# Altium project ASM2464PD.PrjPcb
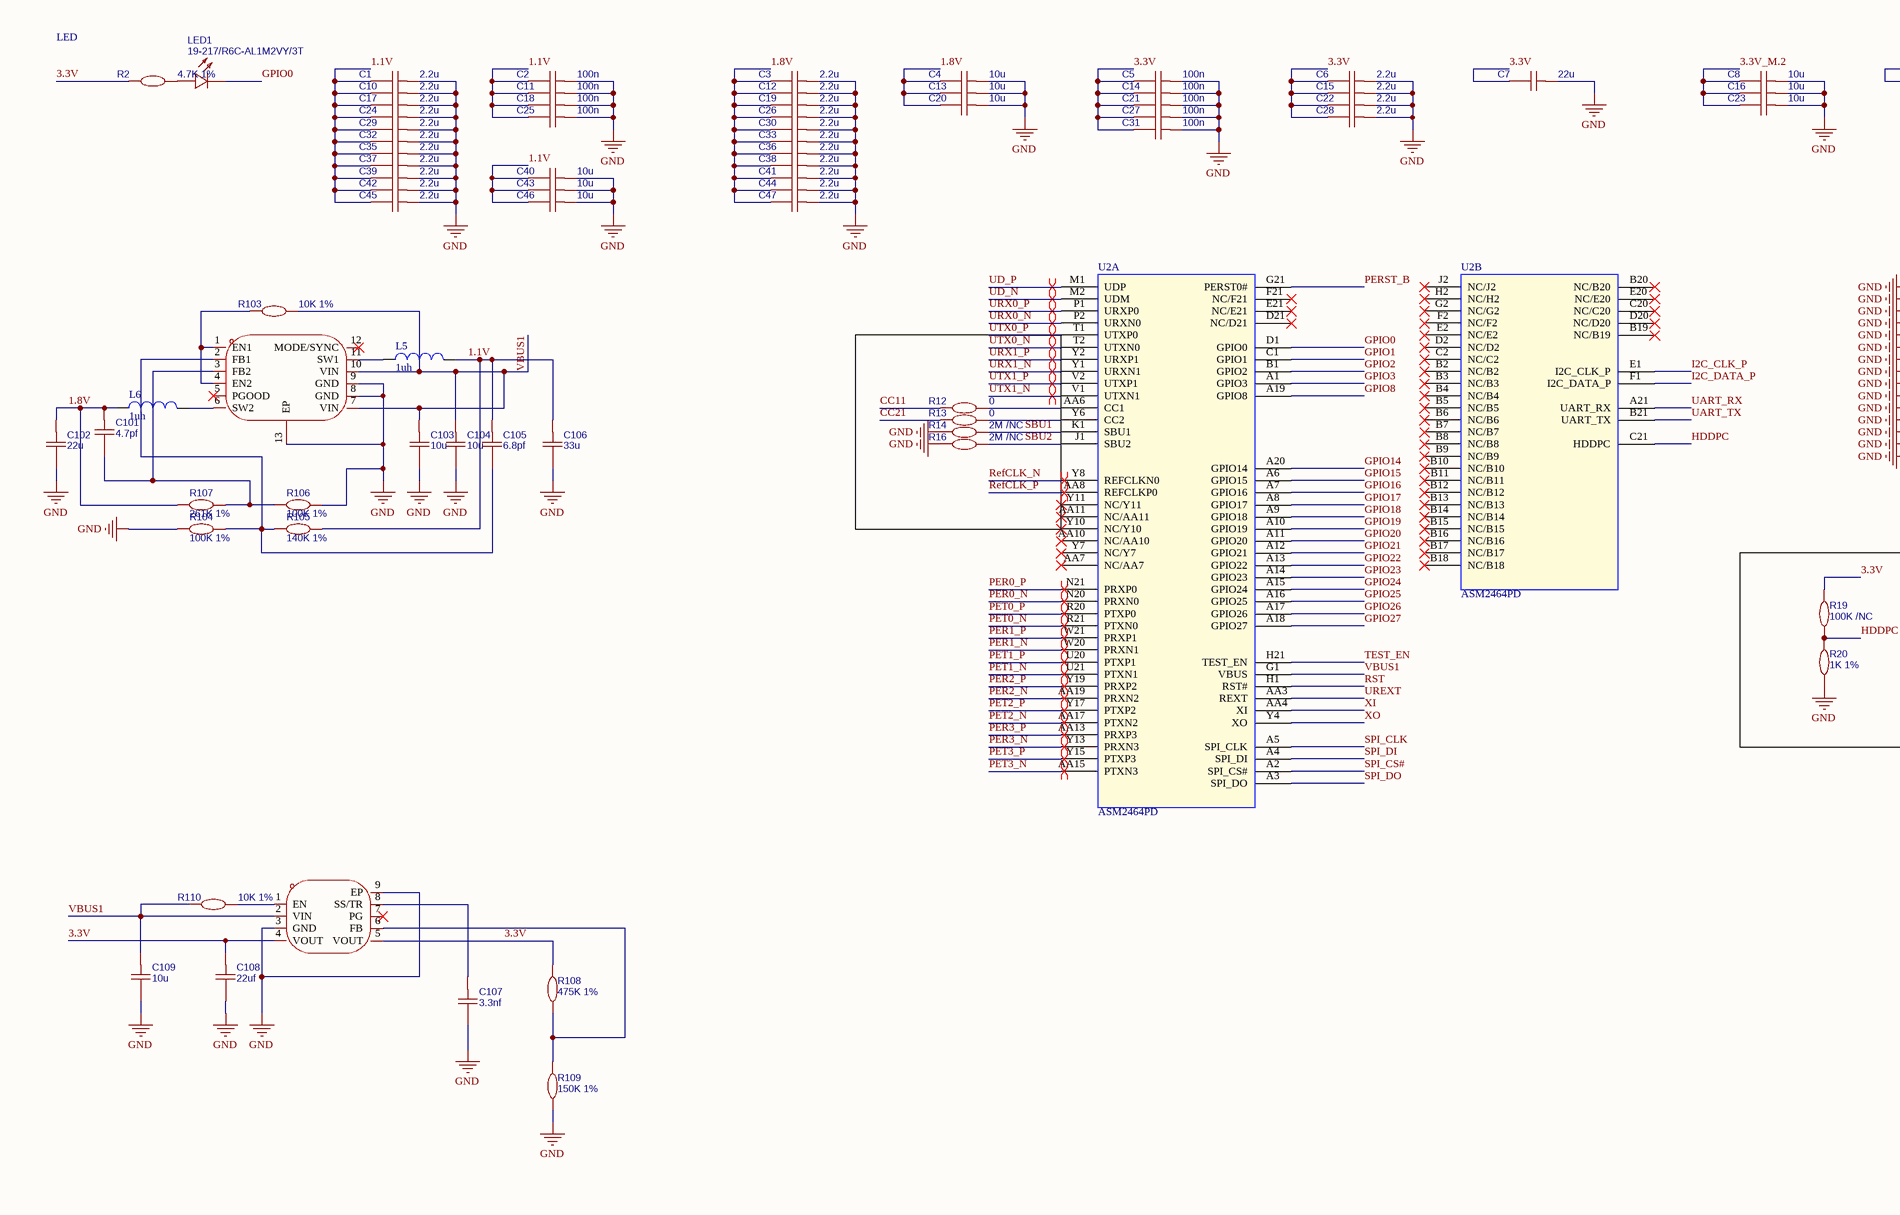
[diagram p0: ASM2464PD.SchDoc, top left]
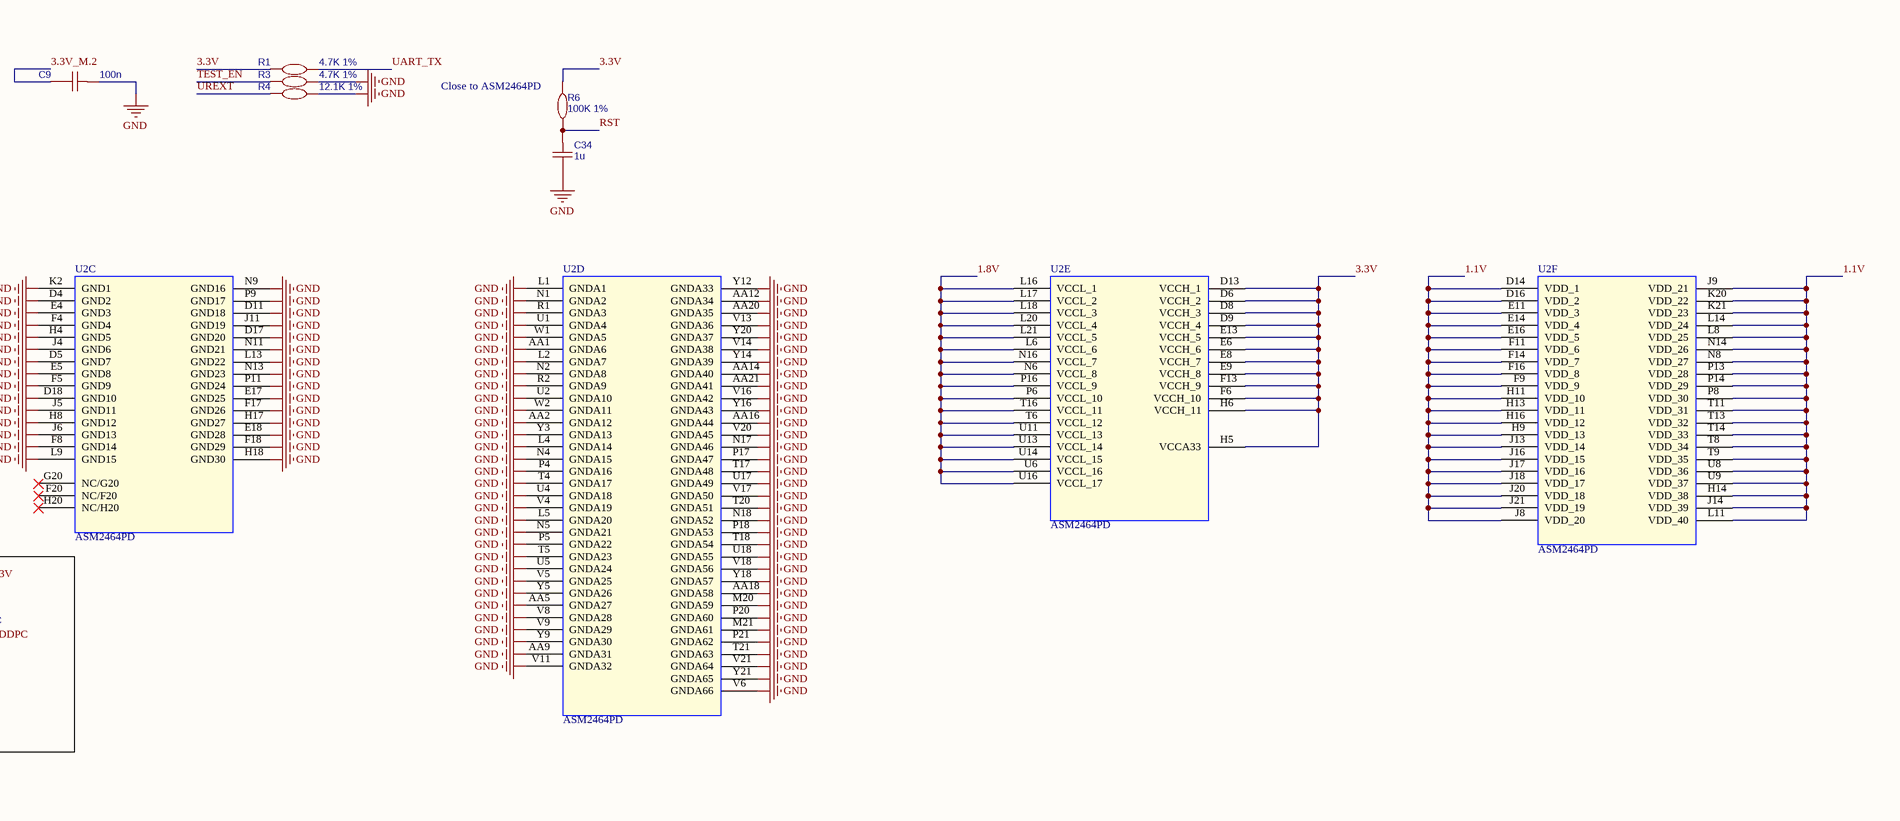
[diagram p1: ASM2464PD.SchDoc, top right]
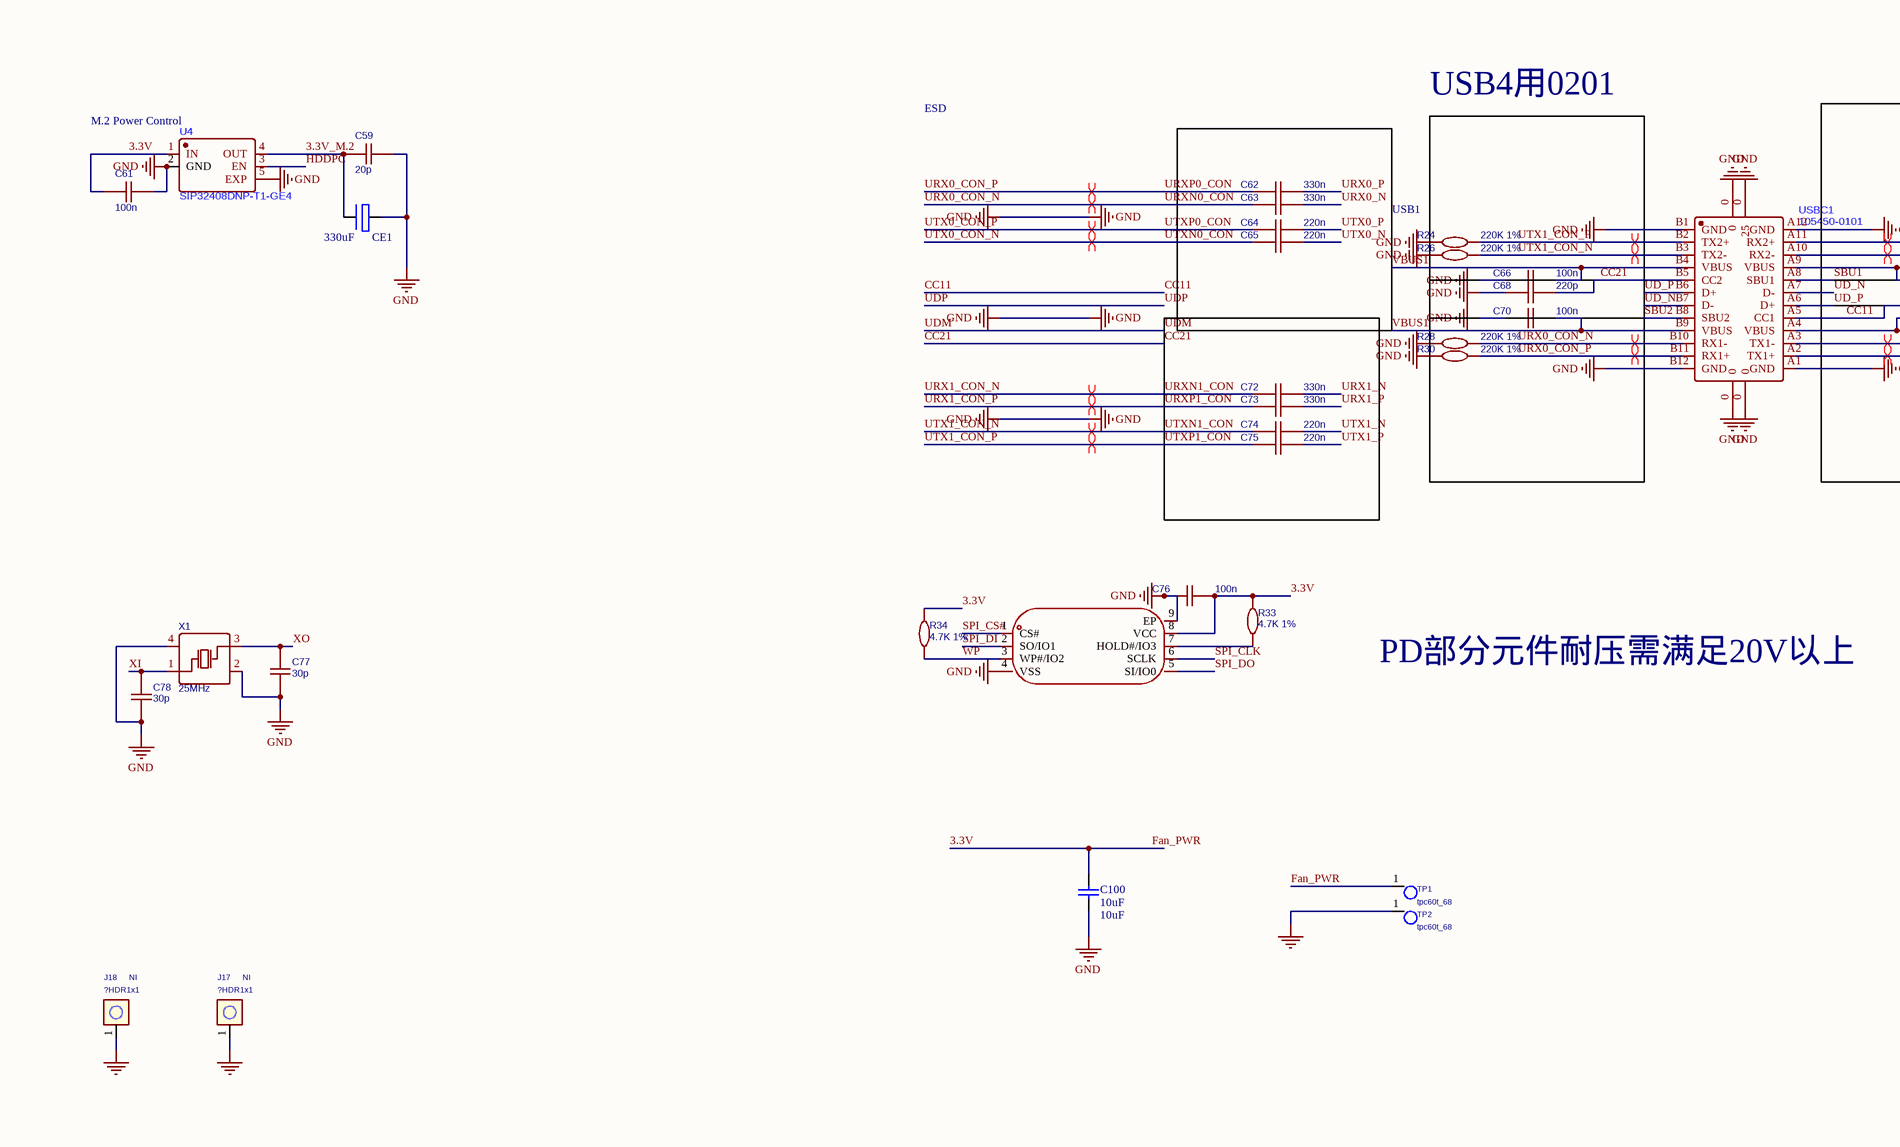
[diagram p2: ASM2464PD.SchDoc, bottom left]
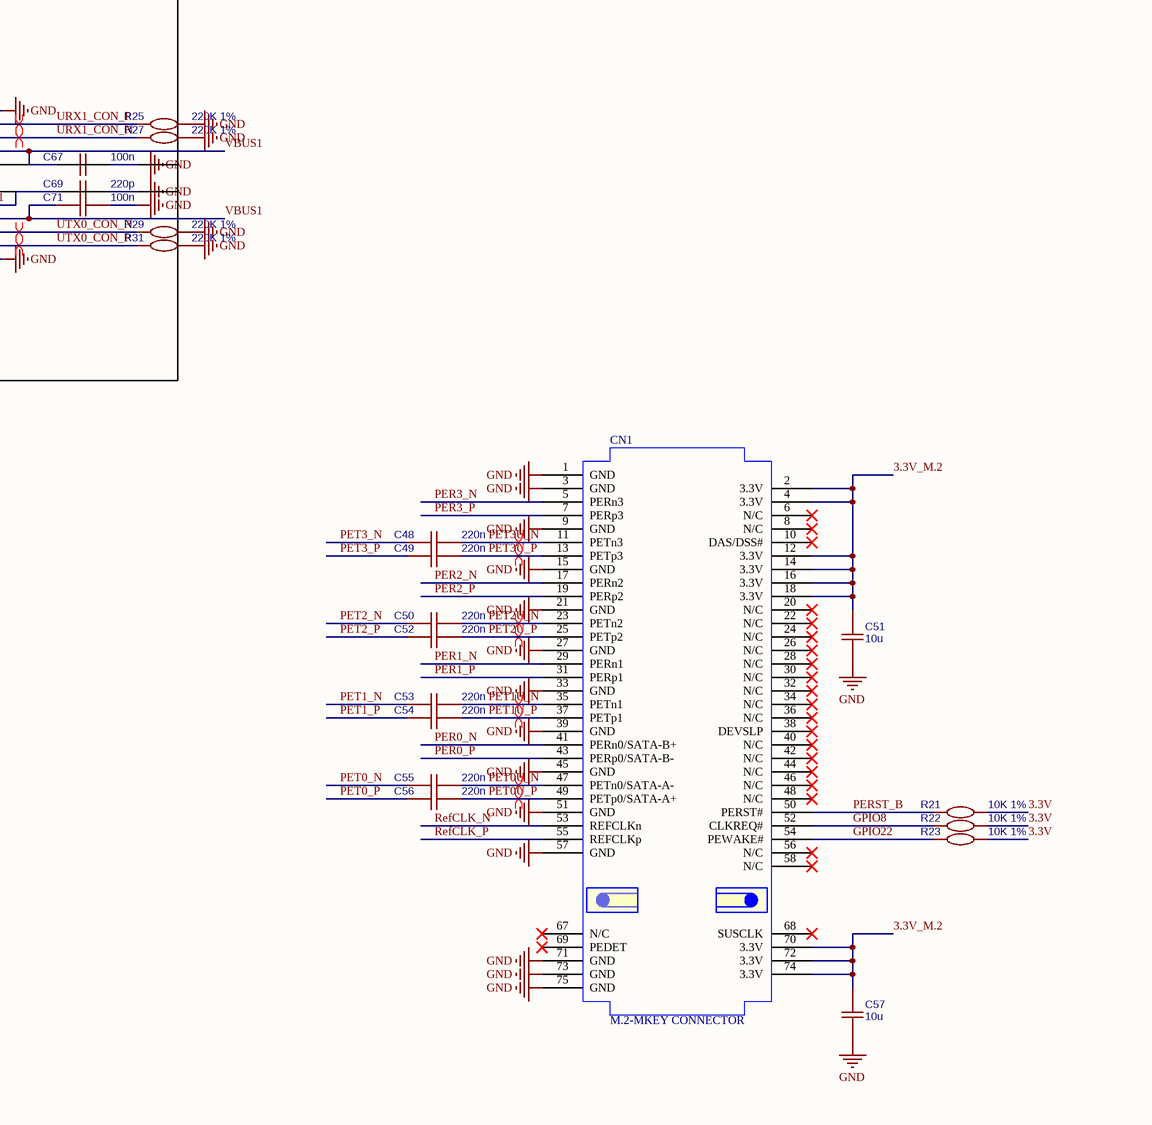
[diagram p3: ASM2464PD.SchDoc, bottom right]
1 sheet, 134 parts. Net scope: global (net labels, ports and power ports of the same name join across sheets).
Board file: ASM2464PD - B2 Sample.PcbDoc

## Sheet ASM2464PD.SchDoc
size A1; SheetNumber: 1; SheetTotal: 1

### Parts
C1  2.2u  [C0402]
C2  100n  [C0402]
C3  2.2u  [C0402]
C4  10u  [C0402]
C5  100n  [C0402]
C6  2.2u  [C0402]
C7  22u  [C0402]
C8  10u  [C0402]
C9  100n  [C0402]
C10  2.2u  [C0402]
C11  100n  [C0402]
C12  2.2u  [C0402]
C13  10u  [C0402]
C14  100n  [C0402]
C15  2.2u  [C0402]
C16  10u  [C0402]
C17  2.2u  [C0402]
C18  100n  [C0402]
C19  2.2u  [C0402]
C20  10u  [C0402]
C21  100n  [C0402]
C22  2.2u  [C0402]
C23  10u  [C0402]
C24  2.2u  [C0402]
C25  100n  [C0402]
C26  2.2u  [C0402]
C27  100n  [C0402]
C28  2.2u  [C0402]
C29  2.2u  [C0402]
C30  2.2u  [C0402]
C31  100n  [C0402]
C32  2.2u  [C0402]
C33  2.2u  [C0402]
C34  1u  [C0402]
C35  2.2u  [C0402]
C36  2.2u  [C0402]
C37  2.2u  [C0402]
C38  2.2u  [C0402]
C39  2.2u  [C0402]
C40  10u  [C0402]
C41  2.2u  [C0402]
C42  2.2u  [C0402]
C43  10u  [C0402]
C44  2.2u  [C0402]
C45  2.2u  [C0402]
C46  10u  [C0402]
C47  2.2u  [C0402]
C48  220n  [C0201]
C49  220n  [C0201]
C50  220n  [C0201]
C51  10u  [C0402]
C52  220n  [C0201]
C53  220n  [C0201]
C54  220n  [C0201]
C55  220n  [C0201]
C56  220n  [C0201]
C57  10u  [C0402]
C59  20p  [C0402]
C61  100n  [C0402]
C62  330n  [C0201]
C63  330n  [C0201]
C64  220n  [C0201]
C65  220n  [C0201]
C66  100n  [C0402]
C67  100n  [C0402]
C68  220p  [C0402]
C69  220p  [C0402]
C70  100n  [C0402]
C71  100n  [C0402]
C72  330n  [C0201]
C73  330n  [C0201]
C74  220n  [C0201]
C75  220n  [C0201]
C76  100n  [C0402]
C77  30p  [C0402]
C78  30p  [C0402]
C100  10uF  [C0402]
C101  4.7pf  [C0402]
C102  22u  [C0402]
C103  10u  [C0402]
C104  10u  [C0402]
C105  6.8pf  [C0402]
C106  33u  [C0402]
C107  3.3nf  [C0402]
C108  22uf  [C0402]
C109  10u  [C0402]
CE1  330uF  [CAP-SMD_L7.3-W4.3-R-RD]
CN1  M.2-MKEY CONNECTOR  [CONN-SMD_APCI0113-P001A]
J17  ?HDR1x1  Installed: NI  [Header]
J18  ?HDR1x1  Installed: NI  [Header]
L5  1uh  [IND-SMD_L2.0-W1.6-B]
L6  1uh  [IND-SMD_L2.0-W1.6-B]
LED1  19-217/R6C-AL1M2VY/3T  [LED0402-RD]
R1  4.7K 1%  [R0402]
R2  4.7K 1%  [R0402]
R3  4.7K 1%  [R0402]
R4  12.1K 1%  [R0402]
R6  100K 1%  [R0402]
R12  0  [R0402]
R13  0  [R0402]
R14  2M /NC  [R0402]
R16  2M /NC  [R0402]
R19  100K /NC  [R0402]
R20  1K 1%  [R0402]
R21  10K 1%  [R0402]
R22  10K 1%  [R0402]
R23  10K 1%  [R0402]
R24  220K 1%  [R0201]
R25  220K 1%  [R0201]
R26  220K 1%  [R0201]
R27  220K 1%  [R0201]
R28  220K 1%  [R0201]
R29  220K 1%  [R0201]
R30  220K 1%  [R0201]
R31  220K 1%  [R0201]
R33  4.7K 1%  [R0402]
R34  4.7K 1%  [R0402]
R103  10K 1%  [R0402]
R104  100K 1%  [R0402]
R105  140K 1%  [R0402]
R106  100K 1%  [R0402]
R107  261K 1%  [R0402]
R108  475K 1%  [R0402]
R109  150K 1%  [R0402]
R110  10K 1%  [R0402]
TP1  tpc60t_68  [tpc60t_68]
TP2  tpc60t_68  [tpc60t_68]
U01  LTC3315AEV#TRPBF  [LQFN-12_L2.0-W2.0-P0.50-TL-EP0.7]  (value not drawn)
U2  ASM2464PD  [BGA273C46P21X21_1000X1000X98]  (parts A,B,C,D,E,F of 6)
U02  TPS82130SILR  [USIP-8_L3.0-W2.8-P0.65-TL-EP]  (value not drawn)
U4  SIP32408DNP-T1-GE4  [SIP32408DNP-T1-GE4]
U31  ZD25WQ16CEIGR  [USON-8_L3.0-W2.0-P0.50-BL-EP]  (value not drawn)
USBC1  105450-0101  [USB-C-SMD_TYPE-C-USB-18]
X1  25MHz  [CRYSTAL-SMD_4P-L1.6-W1.2-BL]

### Blocks framed on the sheet
USB4用0201: C66 C68 C70 R24 R26

### Nets
GND: C1.2 C2.2 C3.2 C4.2 C5.2 C6.2 C7.2 C8.2 C9.2 C10.2 C11.2 C12.2 C13.2 C14.2 C15.2 C16.2 C17.2 C18.2 C19.2 C20.2 C21.2 C22.2 C23.2 C24.2 C25.2 C26.2 C27.2 C28.2 C29.2 C30.2 C31.2 C32.2 C33.2 C34.1 C35.2 C36.2 C37.2 C38.2 C39.2 C40.2 C41.2 C42.2 C43.2 C44.2 C45.2 C46.2 C47.2 C51.2 C57.2 C59.2 C61.2 C66.1 C67.2 C68.1 C69.2 C70.1 C71.2 C76.1 C77.2 C78.2 C100.2 C102.1 C103.1 C104.1 C106.1 C107.1 C108.1 C109.1 CE1.2 CN1.1(GND) CN1.3(GND) CN1.9(GND) CN1.15(GND) CN1.21(GND) CN1.27(GND) CN1.33(GND) CN1.39(GND) CN1.45(GND) CN1.51(GND) CN1.57(GND) CN1.71(GND) CN1.73(GND) CN1.75(GND) J17.1 J18.1 R3.2 R4.2 R14.1 R16.1 R20.1 R24.1 R25.2 R26.1 R27.2 R28.1 R29.2 R30.1 R31.2 R104.2 R106.1 R109.2 TP2.1 U01.8(GND) U01.9(GND) U01.13(EP) U02.3(GND) U02.9(EP) U2.AA1(GNDA6) U2.AA2(GNDA12) U2.AA5(GNDA27) U2.AA9(GNDA31) U2.AA12(GNDA34) U2.AA14(GNDA40) U2.AA16(GNDA44) U2.AA18(GNDA58) U2.AA20(GNDA35) U2.AA21(GNDA41) U2.D4(GND2) U2.D5(GND7) U2.D11(GND18) U2.D17(GND20) U2.D18(GND10) U2.E4(GND3) U2.E5(GND8) U2.E17(GND25) U2.E18(GND28) U2.F4(GND4) U2.F5(GND9) U2.F8(GND14) U2.F17(GND26) U2.F18(GND29) U2.H4(GND5) U2.H8(GND12) U2.H17(GND27) U2.H18(GND30) U2.J4(GND6) U2.J5(GND11) U2.J6(GND13) U2.J11(GND19) U2.K2(GND1) U2.L1(GNDA1) U2.L2(GNDA7) U2.L4(GNDA14) U2.L5(GNDA20) U2.L9(GND15) U2.L13(GND22) U2.M20(GNDA59) U2.M21(GNDA61) U2.N1(GNDA2) U2.N2(GNDA8) U2.N4(GNDA15) U2.N5(GNDA21) U2.N9(GND16) U2.N11(GND21) U2.N13(GND23) U2.N17(GNDA46) U2.N18(GNDA52) U2.P4(GNDA16) U2.P5(GNDA22) U2.P9(GND17) U2.P11(GND24) U2.P17(GNDA47) U2.P18(GNDA53) U2.P20(GNDA60) U2.P21(GNDA62) U2.R1(GNDA3) U2.R2(GNDA9) U2.T4(GNDA17) U2.T5(GNDA23) U2.T17(GNDA48) U2.T18(GNDA54) U2.T20(GNDA51) U2.T21(GNDA63) U2.U1(GNDA4) U2.U2(GNDA10) U2.U4(GNDA18) U2.U5(GNDA24) U2.U17(GNDA49) U2.U18(GNDA55) U2.V4(GNDA19) U2.V5(GNDA25) U2.V6(GNDA66) U2.V8(GNDA28) U2.V9(GNDA29) U2.V11(GNDA32) U2.V13(GNDA36) U2.V14(GNDA38) U2.V16(GNDA42) U2.V17(GNDA50) U2.V18(GNDA56) U2.V20(GNDA45) U2.V21(GNDA64) U2.W1(GNDA5) U2.W2(GNDA11) U2.Y3(GNDA13) U2.Y5(GNDA26) U2.Y9(GNDA30) U2.Y12(GNDA33) U2.Y14(GNDA39) U2.Y16(GNDA43) U2.Y18(GNDA57) U2.Y20(GNDA37) U2.Y21(GNDA65) U4.2(GND) U4.5(EXP) U31.4(VSS) U31.9(EP) USBC1.0 USBC1.A1(GND) USBC1.A12(GND) USBC1.B1(GND) USBC1.B12(GND) X1.2(GND) X1.4(GND)
1.1V: C1.1 C2.1 C10.1 C11.1 C17.1 C18.1 C24.1 C25.1 C29.1 C32.1 C35.1 C37.1 C39.1 C40.1 C42.1 C43.1 C45.1 C46.1 C105.2 C106.2 L5.2 R105.1 U2.D14(VDD_1) U2.D16(VDD_2) U2.E11(VDD_3) U2.E14(VDD_4) U2.E16(VDD_5) U2.F9(VDD_9) U2.F11(VDD_6) U2.F14(VDD_7) U2.F16(VDD_8) U2.H9(VDD_13) U2.H11(VDD_10) U2.H13(VDD_11) U2.H14(VDD_38) U2.H16(VDD_12) U2.J8(VDD_20) U2.J9(VDD_21) U2.J13(VDD_14) U2.J14(VDD_39) U2.J16(VDD_15) U2.J17(VDD_16) U2.J18(VDD_17) U2.J20(VDD_18) U2.J21(VDD_19) U2.K20(VDD_22) U2.K21(VDD_23) U2.L8(VDD_25) U2.L11(VDD_40) U2.L14(VDD_24) U2.N8(VDD_27) U2.N14(VDD_26) U2.P8(VDD_30) U2.P13(VDD_28) U2.P14(VDD_29) U2.T8(VDD_34) U2.T9(VDD_35) U2.T11(VDD_31) U2.T13(VDD_32) U2.T14(VDD_33) U2.U8(VDD_36) U2.U9(VDD_37)
1.8V: C3.1 C4.1 C12.1 C13.1 C19.1 C20.1 C26.1 C30.1 C33.1 C36.1 C38.1 C41.1 C44.1 C47.1 C101.2 C102.2 L6.1 R107.2 U2.L6(VCCL_6) U2.L16(VCCL_1) U2.L17(VCCL_2) U2.L18(VCCL_3) U2.L20(VCCL_4) U2.L21(VCCL_5) U2.N6(VCCL_8) U2.N16(VCCL_7) U2.P6(VCCL_10) U2.P16(VCCL_9) U2.T6(VCCL_12) U2.T16(VCCL_11) U2.U6(VCCL_16) U2.U11(VCCL_13) U2.U13(VCCL_14) U2.U14(VCCL_15) U2.U16(VCCL_17)
3.3V: C5.1 C6.1 C7.1 C14.1 C15.1 C21.1 C22.1 C27.1 C28.1 C31.1 C61.1 C76.2 C100.1 C108.2 R1.1 R2.1 R6.2 R19.2 R21.2 R22.2 R23.2 R33.1 R34.1 R108.1 TP1.1 U02.4(VOUT) U02.5(VOUT) U2.D6(VCCH_2) U2.D8(VCCH_3) U2.D9(VCCH_4) U2.D13(VCCH_1) U2.E6(VCCH_6) U2.E8(VCCH_7) U2.E9(VCCH_8) U2.E13(VCCH_5) U2.F6(VCCH_10) U2.F13(VCCH_9) U2.H5(VCCA33) U2.H6(VCCH_11) U4.1(IN) U31.8(VCC)  [also labelled Fan_PWR]
3.3V_M.2: C8.1 C9.1 C16.1 C23.1 C51.1 C57.1 C59.1 CE1.1 CN1.2(3.3V) CN1.4(3.3V) CN1.12(3.3V) CN1.14(3.3V) CN1.16(3.3V) CN1.18(3.3V) CN1.70(3.3V) CN1.72(3.3V) CN1.74(3.3V) U4.4(OUT)
CC11: C69.1 R12.1 USBC1.A5(CC1)
CC21: C68.2 R13.1 USBC1.B5(CC2)
GPIO0: LED1.2(C) U2.D1(GPIO0)
GPIO1: U2.C1(GPIO1)
GPIO2: U2.B1(GPIO2)
GPIO3: U2.A1(GPIO3)
GPIO8: CN1.52(CLKREQ#) R22.1 U2.A19(GPIO8)
GPIO14: U2.A20(GPIO14)
GPIO15: U2.A6(GPIO15)
GPIO16: U2.A7(GPIO16)
GPIO17: U2.A8(GPIO17)
GPIO18: U2.A9(GPIO18)
GPIO19: U2.A10(GPIO19)
GPIO20: U2.A11(GPIO20)
GPIO21: U2.A12(GPIO21)
GPIO22: CN1.54(PEWAKE#) R23.1 U2.A13(GPIO22)
GPIO23: U2.A14(GPIO23)
GPIO24: U2.A15(GPIO24)
GPIO25: U2.A16(GPIO25)
GPIO26: U2.A17(GPIO26)
GPIO27: U2.A18(GPIO27)
HDDPC: R19.1 R20.2 U2.C21(HDDPC) U4.3(EN)
I2C_CLK_P: U2.E1(I2C_CLK_P)
I2C_DATA_P: U2.F1(I2C_DATA_P)
PER0_N: CN1.41(PERn0/SATA-B+) U2.N20(PRXN0)
PER0_P: CN1.43(PERp0/SATA-B-) U2.N21(PRXP0)
PER1_N: CN1.29(PERn1) U2.W20(PRXN1)
PER1_P: CN1.31(PERp1) U2.W21(PRXP1)
PER2_N: CN1.17(PERn2) U2.AA19(PRXN2)
PER2_P: CN1.19(PERp2) U2.Y19(PRXP2)
PER3_N: CN1.5(PERn3) U2.Y13(PRXN3)
PER3_P: CN1.7(PERp3) U2.AA13(PRXP3)
PERST_B: CN1.50(PERST#) R21.1 U2.G21(PERST0#)
PET0_N: C55.1 U2.R21(PTXN0)
PET0_P: C56.1 U2.R20(PTXP0)
PET0U_N: C55.2 CN1.47(PETn0/SATA-A-)
PET0U_P: C56.2 CN1.49(PETp0/SATA-A+)
PET1_N: C53.1 U2.U21(PTXN1)
PET1_P: C54.1 U2.U20(PTXP1)
PET1U_N: C53.2 CN1.35(PETn1)
PET1U_P: C54.2 CN1.37(PETp1)
PET2_N: C50.1 U2.AA17(PTXN2)
PET2_P: C52.1 U2.Y17(PTXP2)
PET2U_N: C50.2 CN1.23(PETn2)
PET2U_P: C52.2 CN1.25(PETp2)
PET3_N: C48.1 U2.AA15(PTXN3)
PET3_P: C49.1 U2.Y15(PTXP3)
PET3U_N: C48.2 CN1.11(PETn3)
PET3U_P: C49.2 CN1.13(PETp3)
RefCLK_N: CN1.53(REFCLKn) U2.Y8(REFCLKN0)
RefCLK_P: CN1.55(REFCLKp) U2.AA8(REFCLKP0)
RST: C34.2 R6.1 U2.H1(RST#)
SBU1: R14.2 U2.K1(SBU1) USBC1.A8(SBU1)
SBU2: R16.2 U2.J1(SBU2) USBC1.B8(SBU2)
SPI_CLK: U2.A5(SPI_CLK) U31.6(SCLK)
SPI_CS#: U2.A2(SPI_CS#) U31.1(CS#)
SPI_DI: U2.A4(SPI_DI) U31.2(SO/IO1)
SPI_DO: U2.A3(SPI_DO) U31.5(SI/IO0)
TEST_EN: R3.1 U2.H21(TEST_EN)
UART_RX: U2.A21(UART_RX)
UART_TX: R1.2 U2.B21(UART_TX)
UD_N: U2.M2(UDM) USBC1.A7(D-) USBC1.B7(D-)
UD_P: U2.M1(UDP) USBC1.A6(D+) USBC1.B6(D+)
UREXT: R4.1 U2.AA3(REXT)
URX0_CON_N: C63.1 R28.2 USBC1.B10(RX1-)  [also labelled URXN0_CON]
URX0_CON_P: C62.1 R30.2 USBC1.B11(RX1+)  [also labelled URXP0_CON]
URX0_N: C63.2 U2.P2(URXN0)
URX0_P: C62.2 U2.P1(URXP0)
URX1_CON_N: C72.1 R27.1 USBC1.A10(RX2-)  [also labelled URXN1_CON]
URX1_CON_P: C73.1 R25.1 USBC1.A11(RX2+)  [also labelled URXP1_CON]
URX1_N: C72.2 U2.Y1(URXN1)
URX1_P: C73.2 U2.Y2(URXP1)
UTX0_CON_N: C65.1 R29.1 USBC1.A3(TX1-)  [also labelled UTXN0_CON]
UTX0_CON_P: C64.1 R31.1 USBC1.A2(TX1+)  [also labelled UTXP0_CON]
UTX0_N: C65.2 U2.T2(UTXN0)
UTX0_P: C64.2 U2.T1(UTXP0)
UTX1_CON_N: C74.1 R26.2 USBC1.B3(TX2-)  [also labelled UTXN1_CON]
UTX1_CON_P: C75.1 R24.2 USBC1.B2(TX2+)  [also labelled UTXP1_CON]
UTX1_N: C74.2 U2.V1(UTXN1)
UTX1_P: C75.2 U2.V2(UTXP1)
VBUS1: C66.2 C67.1 C70.2 C71.1 C103.2 C104.2 C109.2 R103.2 R110.1 U01.7(VIN) U01.10(VIN) U02.2(VIN) U2.G1(VBUS) USBC1.A4(VBUS) USBC1.A9(VBUS) USBC1.B4(VBUS) USBC1.B9(VBUS)
WP: R34.2 U31.3(WP#/IO2)
XI: C78.1 U2.AA4(XI) X1.1(OSC1)
XO: C77.1 U2.Y4(XO) X1.3(OSC2)
NetC101_1: C101.1 R106.2 R107.1 U01.3(FB2)
NetC105_1: C105.1 R104.1 R105.2 U01.2(FB1)
NetC107_2: C107.2 U02.8(SS/TR)
NetL5_1: L5.1 U01.11(SW1)
NetL6_2: L6.2 U01.6(SW2)
NetLED1_1: LED1.1(A) R2.2
NetR12_2: R12.2 U2.AA6(CC1)
NetR13_2: R13.2 U2.Y6(CC2)
NetR33_2: R33.2 U31.7(HOLD#/IO3)
NetR103_1: R103.1 U01.1(EN1) U01.4(EN2)
NetR108_2: R108.2 R109.1 U02.6(FB)
NetR110_2: R110.2 U02.1(EN)

Not connected (* = marked no-connect by the designer): CN1 6(N/C)* 8(N/C)* 10(DAS/DSS#)* 20(N/C)* 22(N/C)* 24(N/C)* 26(N/C)* 28(N/C)* 30(N/C)* 32(N/C)* 34(N/C)* 36(N/C)* 38(DEVSLP)* 40(N/C)* 42(N/C)* 44(N/C)* 46(N/C)* 48(N/C)* 56(N/C)* 58(N/C)* 67(N/C)* 68(SUSCLK)* 69(PEDET)*; U01 5(PGOOD)* 12(MODE/SYNC)*; U2 AA7(NC/AA7)* AA10(NC/AA10)* AA11(NC/AA11)* B2(NC/B2)* B3(NC/B3)* B4(NC/B4)* B5(NC/B5)* B6(NC/B6)* B7(NC/B7)* B8(NC/B8)* B9(NC/B9)* B10(NC/B10)* B11(NC/B11)* B12(NC/B12)* B13(NC/B13)* B14(NC/B14)* B15(NC/B15)* B16(NC/B16)* B17(NC/B17)* B18(NC/B18)* B19(NC/B19)* B20(NC/B20)* C2(NC/C2)* C20(NC/C20)* D2(NC/D2)* D20(NC/D20)* D21(NC/D21)* E2(NC/E2)* E20(NC/E20)* E21(NC/E21)* F2(NC/F2)* F20(NC/F20)* F21(NC/F21)* G2(NC/G2)* G20(NC/G20)* H2(NC/H2)* H20(NC/H20)* J2(NC/J2)* Y7(NC/Y7)* Y10(NC/Y10)* Y11(NC/Y11)*; U02 7(PG)*

### Layout directives
differential pair: PER0_N, PER0_P, PER1_N, PER1_P, PER2_N, PER2_P, PER3_N, PER3_P, PET0_N, PET0_P, PET0U_N, PET0U_P, PET1_N, PET1_P, PET1U_N, PET1U_P, PET2_N, PET2_P, PET2U_N, PET2U_P, PET3_N, PET3_P, PET3U_N, PET3U_P, RefCLK_N, RefCLK_P, UD_N, UD_P, URX0_CON_N, URX0_CON_P, URX0_N, URX0_P, URX1_CON_N, URX1_CON_P, URX1_N, URX1_P, UTX0_CON_N, UTX0_CON_P, UTX0_N, UTX0_P, UTX1_CON_N, UTX1_CON_P, UTX1_N, UTX1_P

### Notes on the sheet
- LED
- (near R6) Close to ASM2464PD
- (near U4) M.2 Power Control
- ESD
- USB1
- PD部分元件耐压需满足20V以上

### Library data of the parts
C1-C9 C39-C42 C44 C45 C47 C76 C102-C104 C106 C109 = 1u: PIN2; BOM_Manufacturer: SAMSUNG; BOM_Manufacturer Part: CL10B104KB8NNNC; nameAlias: Capacitance; BOM_Supplier: LCSC; BOM_Supplier Part: C1591; spicePre: C; spiceSymbolName: CL10B104KB8NNNC
C10-C16 C43 = 1u: PIN31 20u->22u; BOM_Manufacturer: SAMSUNG; BOM_Manufacturer Part: CL10B104KB8NNNC; nameAlias: Capacitance; BOM_Supplier: LCSC; BOM_Supplier Part: C1591; spicePre: C; spiceSymbolName: CL10B104KB8NNNC
C17-C23 C46 = 1u: PIN53; BOM_Manufacturer: SAMSUNG; BOM_Manufacturer Part: CL10B104KB8NNNC; nameAlias: Capacitance; BOM_Supplier: LCSC; BOM_Supplier Part: C1591; spicePre: C; spiceSymbolName: CL10B104KB8NNNC
C24-C28 C31 = 1u: PIN20; BOM_Manufacturer: SAMSUNG; BOM_Manufacturer Part: CL10B104KB8NNNC; nameAlias: Capacitance; BOM_Supplier: LCSC; BOM_Supplier Part: C1591; spicePre: C; spiceSymbolName: CL10B104KB8NNNC
C29 C30 = 1u: PIN25; BOM_Manufacturer: SAMSUNG; BOM_Manufacturer Part: CL10B104KB8NNNC; nameAlias: Capacitance; BOM_Supplier: LCSC; BOM_Supplier Part: C1591; spicePre: C; spiceSymbolName: CL10B104KB8NNNC
C32 C33 = 1u: PIN30; BOM_Manufacturer: SAMSUNG; BOM_Manufacturer Part: CL10B104KB8NNNC; nameAlias: Capacitance; BOM_Supplier: LCSC; BOM_Supplier Part: C1591; spicePre: C; spiceSymbolName: CL10B104KB8NNNC
C34 C48-C57 C59 C61-C75 C77 C78 C101 C105 C107 C108 = 1u: BOM_Manufacturer: SAMSUNG; BOM_Manufacturer Part: CL10B104KB8NNNC; nameAlias: Capacitance; BOM_Supplier: LCSC; BOM_Supplier Part: C1591; spicePre: C; spiceSymbolName: CL10B104KB8NNNC
C35 C36 = 1u: PIN33; BOM_Manufacturer: SAMSUNG; BOM_Manufacturer Part: CL10B104KB8NNNC; nameAlias: Capacitance; BOM_Supplier: LCSC; BOM_Supplier Part: C1591; spicePre: C; spiceSymbolName: CL10B104KB8NNNC
C37 C38 = 1u: PIN36; BOM_Manufacturer: SAMSUNG; BOM_Manufacturer Part: CL10B104KB8NNNC; nameAlias: Capacitance; BOM_Supplier: LCSC; BOM_Supplier Part: C1591; spicePre: C; spiceSymbolName: CL10B104KB8NNNC
C100 = Cap: Published: 8-Jun-2000; LatestRevisionDate: 17-Jul-2002; LatestRevisionNote: Re-released for DXP Platform.; PackageReference: RAD-0.3; Publisher: Altium Limited; PackageDescription: Radial Cap, Thru-Hole; 2 Leads; 0.3 in Pin Spacing; Value: 10uF
CE1 = CTS-10uF/16V-3.5X2_2.8-嗪借B: 100uF/35V; 瞶坝: ぱよ; 紅坝腹: CT10UM16VSB; 顶糷: ...3; 砏: 10uF/16V-3.5*2.8-B; 腹: ECTC-00002-000; 珇: 嗪借筿甧-SMD; PCB Footprint: CE-5X7-L90-100UF
CN1 = M.2-MKEY: M2.-MKEY connector; CRITICAL_PART: N; MANUFACTURER: FOXCONN; MANUFACTURER_PN: AS0BC2X-S40BX-7H; PART_NUMBER: 12G103002250; PART_TYPE: 12_CON; PCB Footprint: NGFP75P-2; TABLES: 12; OPTIONAL: I; CLASS: Connector; COMPONENT_NAME: M2.-MKEY connector; CREATED_DATE: 2019/1/30; DATABASE_UPDATE: 2019/1/30; DATASHEET: T:\division\Division_Share\JM_CIS_Database\05_Datasheet\12_Connector\12G103002250.pdf; ELECTRIC_SPEC: N/A; PACKAGE_TYPE: SMD; QVL_APPROVE: N; TOLERANCE: N/A
J17 J18 = 001_TP_HDR1x1: Part Number: 88; ROOM: POE_MECH
L5 L6 = Inductor: Code_IEC: 1005; Published: 8-Jun-2000; LatestRevisionDate: 29-May-2009; LatestRevisionNote: IPC-7351 Footprint Added.; PackageReference: 0402-A; Publisher: Altium Limited; PackageDescription: Chip Inductor; Code_JEITA: 0402
LED1 = 19-217/R6C-AL1M2VY/3T: BOM_Manufacturer: EVERLIGHT; SMT Type: Extend; BOM_Supplier: LCSC; BOM_Manufacturer Part: 19-217/R6C-AL1M2VY/3T; image: //image.lceda.cn/szlcsc/C72044.jpg; BOM_Supplier Part: C72044; BOM_LCSC Assembly: Yes; spicePre: L; spiceSymbolName: 19-217/R6C-AL1M2VY/3T
R1-R4 R6 R12-R14 R16 R19-R31 R33 R34 R103-R110 = 10K: BOM_Manufacturer: UniOhm; BOM_Manufacturer Part: 0603WAF1001T5E; nameAlias: Resistance (Ohms); SMT Type: Basic; BOM_Supplier: LCSC; BOM_LCSC Assembly: Yes; BOM_Supplier Part: C21190; spicePre: R; spiceSymbolName: 0603WAF1001T5E
TP1 TP2 = test_point: FOR ASUS NB ENTEK; Critical_Part: N; Part Number: temp_3941_pj16; FPLIST: tpc60t_68,nb_tpc60t_68,tpc60t_68; Component_Name: TEST POINT CIRCLE 60MIL(TOP); Colay_Alternate: N/A; Colay_Group: N/A; Subsystem_ID: N/A; Optional: N/A; Modify_data: 2014/06/09; Database_Update: 2005/3/15; Part Type: 13MECHANICAL\SMD; Device: tpc60t_68; Package_Type: SMD
U01 = LTC3315AEV#TRPBF: Manufacturer: ADI(亚德诺); Add into BOM: yes; Function: 降压型; Output Type: 固定; Input Voltage: 2.25V~5.5V; Output Voltage: 500mV~5.5V; Output Current (Max): 2A; Switching Frequency: 3MHz; Synchronous Rectification: 是; Number of Outputs: 2; Topology: 降压式; Switch tube (built-in/external): 内置; Symbol: LTC3315AEV#TRPBF; Device: LTC3315AEV#TRPBF; LCSC Part Name: LTC3315AEV#TRPBF; Supplier Part: C684471; Manufacturer Part: LTC3315AEV#TRPBF; Supplier Footprint: LQFN-12-EP(2x2); JLCPCB Part Class: Extended Part; Datasheet: https://atta.szlcsc.com/upload/public/pdf/source/20200727/C684471_DF630FB0903BFE14250A63036F5B7B2B.pdf; Supplier: LCSC; Convert to PCB: yes; Operating Temperature: -40℃~+125℃@(TJ)
U2 = TEST_CHIP_BGA273_1: ASMEDIA; Part Number: temp_T_004530; Manufacture: N; Component_Name: TEST CHIP BGA 273; Data_Sheet: J:\DataSheet\02-CHIPSET\temp_T_004530.zip; Device: s_bga_273p_18_26_394x394; Symbol_Preview: http://tp-caevm-01/ET_Main/FpPre.aspx?PN=temp_T_004530&LIB=MBPOOL; Package_Type: SMD; Part Type: 02CHIPSET\AD; Optional: N/A; Subsystem_ID: N/A; Colay_Group: N/A; Colay_Alternate: N/A; PCB Footprint: s_bga_273p_18_26_394x394
U02 = TPS82130SILR: Manufacturer: TI(德州仪器); Add into BOM: yes; Symbol: TPS82130SILR; Device: TPS82130SILR; LCSC Part Name: TPS82130SILR; Supplier Part: C473914; Manufacturer Part: TPS82130SILR; Supplier Footprint: USIP-8; JLCPCB Part Class: Extended Part; Datasheet: https://www.ti.com/cn/lit/gpn/tps82130; Supplier: LCSC; Convert to PCB: yes
U31 = ZD25WQ16CEIGR: Manufacturer: Zetta(澜智); Add into BOM: yes; Interface Type: SPI; Memory Size: 16Mbit; Clock Frequency (fc): 104MHz; Supply Voltage: 1.65V~3.6V; Page Programming Time (Tpp): 2ms; Block Erase Time (tBE): 12ms@(32KB); Data Retention - TDR (Year): 20年; Symbol: ZD25WQ16CEIGR; Device: ZD25WQ16CEIGR; LCSC Part Name: ZD25WQ16CEIGR; Supplier Part: C7304007; Manufacturer Part: ZD25WQ16CEIGR; Supplier Footprint: USON-8(2x3); JLCPCB Part Class: Extended Part; Datasheet: https://atta.szlcsc.com/upload/public/pdf/source/20230227/377F8688CFA586E30BAF3C1DACB7B6CC.pdf; Supplier: LCSC; Convert to PCB: yes; Operating Temperature: -40℃~+85℃
X1 = 25MHz: BOM_Manufacturer: YXC; BOM_Manufacturer Part: X322525MSB4SI; nameAlias: Frequency; SMT Type: Extend; BOM_Supplier: LCSC; BOM_Supplier Part: C13740; BOM_LCSC Assembly: Yes; spicePre: X; spiceSymbolName: X322525MSB4SI